# Altium schematic sheet MCU.SchDoc
size A4
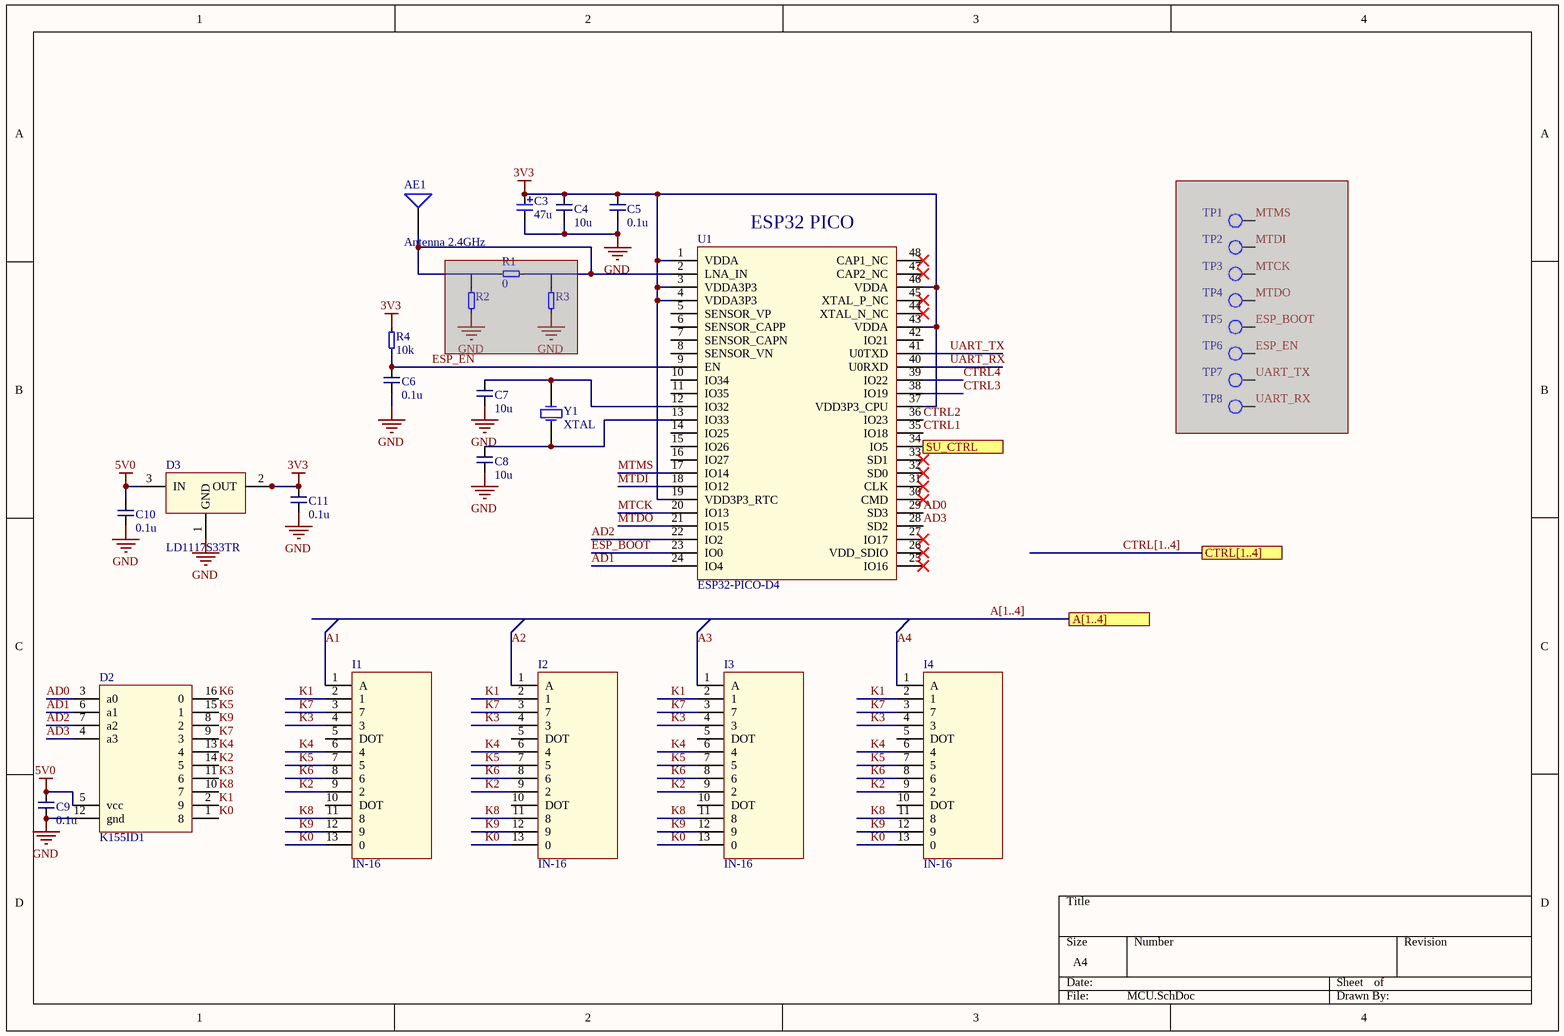
[diagram p0: MCU.SchDoc]

## Parts
AE1  Antenna 2.4GHz  [Antenna 2.4Ghz]  (no BOM)
C3  value 47u  [cap_tant_0603]  (hidden comment: F980J476MMA)
C4  value 10u  [cap 0402]
C5  value 0.1u  [cap 0402]
C6  value 0.1u  [cap 0402]
C7  value 10u  [cap 0402]
C8  value 10u  [cap 0402]
C9  value 0.1u  [cap 0402]
C10  value 0.1u  [cap 0402]
C11  value 0.1u  [cap 0402]
D2  K155ID1  [DIP16]
D3  LD1117S33TR  [SOT223_N]
I1  IN-16  [IN-16]
I2  IN-16  [IN-16]
I3  IN-16  [IN-16]
I4  IN-16  [IN-16]
R1  value 0  [res 0402]  (masked out: inside a compile mask, not in the netlist)
R2  (no value)  [res 0402]  (masked out: inside a compile mask, not in the netlist)
R3  (no value)  [res 0402]  (masked out: inside a compile mask, not in the netlist)
R4  value 10k  [res 0402]
TP1  test_point_1mm  [test_point_1mm]  (value not drawn)  (no BOM)  (masked out: inside a compile mask, not in the netlist)
TP2  test_point_1mm  [test_point_1mm]  (value not drawn)  (no BOM)  (masked out: inside a compile mask, not in the netlist)
TP3  test_point_1mm  [test_point_1mm]  (value not drawn)  (no BOM)  (masked out: inside a compile mask, not in the netlist)
TP4  test_point_1mm  [test_point_1mm]  (value not drawn)  (no BOM)  (masked out: inside a compile mask, not in the netlist)
TP5  test_point_1mm  [test_point_1mm]  (value not drawn)  (no BOM)  (masked out: inside a compile mask, not in the netlist)
TP6  test_point_1mm  [test_point_1mm]  (value not drawn)  (no BOM)  (masked out: inside a compile mask, not in the netlist)
TP7  test_point_1mm  [test_point_1mm]  (value not drawn)  (no BOM)  (masked out: inside a compile mask, not in the netlist)
TP8  test_point_1mm  [test_point_1mm]  (value not drawn)  (no BOM)  (masked out: inside a compile mask, not in the netlist)
U1  ESP32-PICO-D4  [ESP32-PICO-D4_Round_corner_pads]
Y1  XTAL  [32.768khz_quartz]

## Ports
A[1..4], CTRL[1..4], SU_CTRL

## Nets
3V3: C3.1 C4.1 C5.1 C11.1 D3.2(OUT) D3.4 R4.1 U1.1(VDDA) U1.3(VDDA3P3) U1.4(VDDA3P3) U1.19(VDD3P3_RTC) U1.37(VDD3P3_CPU) U1.43(VDDA) U1.46(VDDA)
5V0: C9.1 C10.1 D2.5(vcc) D3.3(IN)
GND: C3.2 C4.2 C5.2 C6.2 C7.2 C8.2 C9.2 C10.2 C11.2 D2.12(gnd) D3.1(GND) U1.49
A1: I1.1(A)
A2: I2.1(A)
A3: I3.1(A)
A4: I4.1(A)
AD0: D2.3(a0) U1.29(SD3)
AD1: D2.6(a1) U1.24(IO4)
AD2: D2.7(a2) U1.22(IO2)
AD3: D2.4(a3) U1.28(SD2)
CTRL1: U1.35(IO18)
CTRL2: U1.36(IO23)
CTRL3: U1.38(IO19)
CTRL4: U1.39(IO22)
ESP_BOOT: U1.23(IO0)
ESP_EN: C6.1 R4.2 U1.9(EN)
K0: D2.1(8) I1.13(0) I2.13(0) I3.13(0) I4.13(0)
K1: D2.2(9) I1.2(1) I2.2(1) I3.2(1) I4.2(1)
K2: D2.14(5) I1.9(2) I2.9(2) I3.9(2) I4.9(2)
K3: D2.11(6) I1.4(3) I2.4(3) I3.4(3) I4.4(3)
K4: D2.13(4) I1.6(4) I2.6(4) I3.6(4) I4.6(4)
K5: D2.15(1) I1.7(5) I2.7(5) I3.7(5) I4.7(5)
K6: D2.16(0) I1.8(6) I2.8(6) I3.8(6) I4.8(6)
K7: D2.9(3) I1.3(7) I2.3(7) I3.3(7) I4.3(7)
K8: D2.10(7) I1.11(8) I2.11(8) I3.11(8) I4.11(8)
K9: D2.8(2) I1.12(9) I2.12(9) I3.12(9) I4.12(9)
MTCK: U1.20(IO13)
MTDI: U1.18(IO12)
MTDO: U1.21(IO15)
MTMS: U1.17(IO14)
SU_CTRL: U1.34(IO5) ; port SU_CTRL
UART_RX: U1.40(U0RXD)
UART_TX: U1.41(U0TXD)
NetAE1_1: AE1.1 U1.2(LNA_IN)
NetC7_1: C7.1 U1.12(IO32) Y1.2(OSC2)
NetC8_1: C8.1 U1.13(IO33) Y1.1(OSC1)

Not connected (* = marked no-connect by the designer): I1 5(DOT) 10(DOT); I2 5(DOT) 10(DOT); I3 5(DOT) 10(DOT); I4 5(DOT) 10(DOT); U1 5(SENSOR_VP) 6(SENSOR_CAPP) 7(SENSOR_CAPN) 8(SENSOR_VN) 10(IO34) 11(IO35) 14(IO25) 15(IO26) 16(IO27) 25(IO16)* 26(VDD_SDIO)* 27(IO17)* 30(CMD)* 31(CLK)* 32(SD0)* 33(SD1)* 42(IO21) 44(XTAL_N_NC)* 45(XTAL_P_NC)* 47(CAP2_NC)* 48(CAP1_NC)*

## Buses and harness runs
bus A[1..4] = port A[1..4]
bus CTRL[1..4] = port CTRL[1..4]

## Notes on the sheet
- (near U1) ESP32 PICO

## Library data of the parts
C3 = cap_tant: CAP TANT 47UF 20% 6.3V 0603; P/N: F980J476MMA
C4 C7 C8 = cap_small: CAP CER 10UF 6.3V X5R 0402; P/N: GRJ155R60J106ME11D
C5 C6 C9-C11 = cap_small: CAP CER 0.1UF 10V X5R 0402; P/N: CL05A104MP5NNNC
R1 = res_small: RES 0 OHM JUMPER 1/16W 0402; P/N: RMCF0402ZT0R00
R2 R3 = res_small: P/N: DNP
R4 = res_small: RES SMD 10K OHM 1% 1/16W 0402; P/N: RC0402FR-0710KL
U1 = ESP32-PICO-D4: ESP32 WIFI BLUETOOTH; P/N: ESP32-PICO-D4
Y1 = XTAL: Crystal Oscillator; Published: 8-Jun-2000; LatestRevisionDate: 17-Jul-2002; LatestRevisionNote: Re-released for DXP Platform.; PackageReference: R38; Publisher: Altium Limited; PackageDescription: Crystal, Thru-Hole; 2 Leads; Body 3.1 x 8.2 mm (Dia.xH)